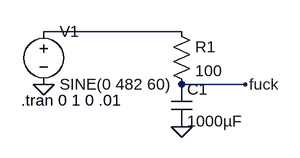
[diagram p0: schematic ripplecompensator.asc]
ripplecompensator.asc, the LTspice schematic file:
Version 4
SHEET 1 880 680
WIRE 320 96 112 96
WIRE 416 176 320 176
FLAG 112 176 0
FLAG 320 240 0
FLAG 416 176 fuck
SYMBOL voltage 112 80 R0
WINDOW 123 0 0 Left 2
WINDOW 39 0 0 Left 2
SYMATTR InstName V1
SYMATTR Value SINE(0 482 60)
SYMBOL res 304 80 R0
SYMATTR InstName R1
SYMATTR Value 100
SYMBOL cap 304 176 R0
SYMATTR InstName C1
SYMATTR Value 1000µF
TEXT 78 200 Left 2 !.tran 0 1 0 .01

The netlist it stands for:
* ripplecompensator.asc
V1 N001 0 SINE(0 482 60)
R1 N001 fuck 100
C1 fuck 0 1000µF
.tran 0 1 0 .01
.backanno
.end